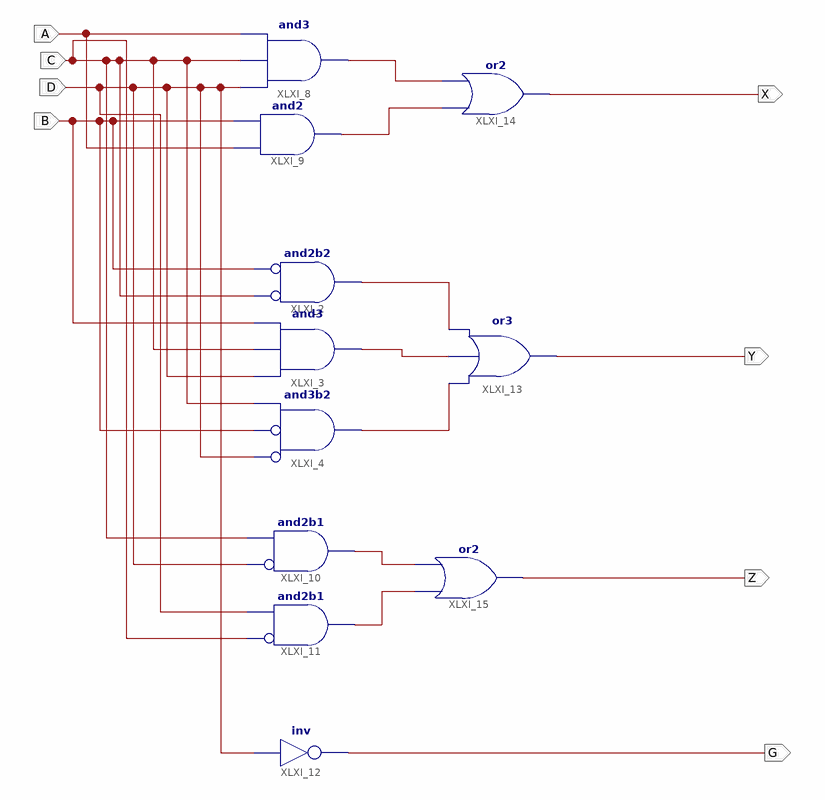
[diagram p0: schematic sheet 1]
// Xilinx ISE schematic tk.sch (artix7) as structural Verilog: 11 symbols, 8 ports
module tk (
  input  A,
  input  C,
  input  D,
  input  B,
  output X,
  output Y,
  output Z,
  output G
);

  wire XLXN_1, XLXN_2, XLXN_3, XLXN_4, XLXN_5, XLXN_6, XLXN_7;

  and XLXI_2 (XLXN_3, ~C, ~B);  // and2b2
  and XLXI_3 (XLXN_4, D, C, B);
  and XLXI_4 (XLXN_5, ~D, ~B, C);  // and3b2
  and XLXI_8 (XLXN_1, D, C, A);
  and XLXI_9 (XLXN_2, A, B);
  and XLXI_10 (XLXN_6, ~D, C);  // and2b1
  and XLXI_11 (XLXN_7, ~C, D);  // and2b1
  not XLXI_12 (G, D);
  or XLXI_13 (Y, XLXN_5, XLXN_4, XLXN_3);
  or XLXI_14 (X, XLXN_2, XLXN_1);
  or XLXI_15 (Z, XLXN_7, XLXN_6);
endmodule
